# Altium schematic sheet Power.SchDoc
size A4
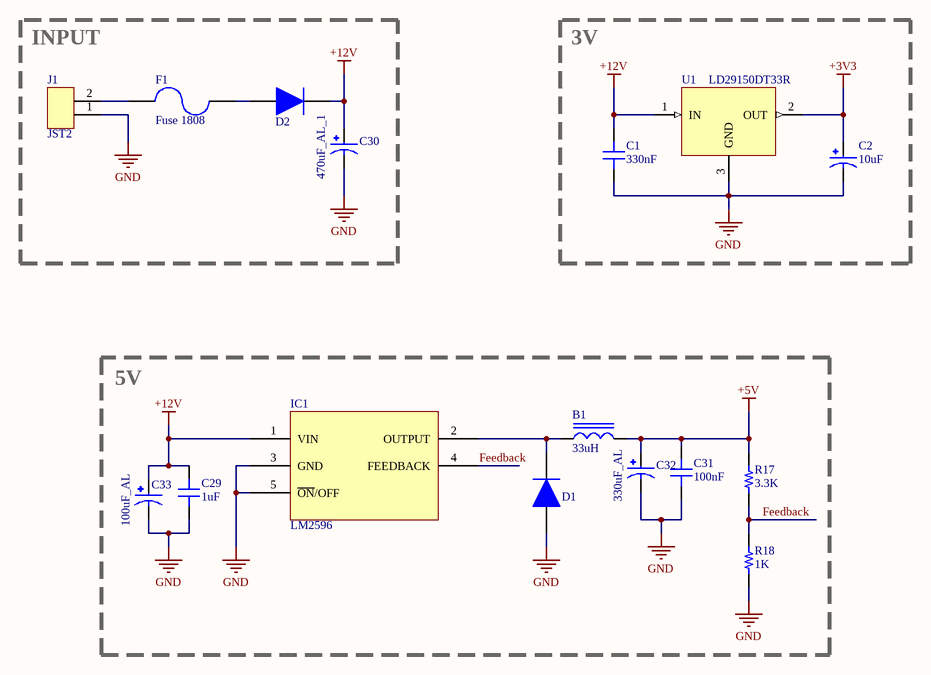
[diagram p0: Power.SchDoc]

## Parts
B1  33uH  [DR125]
C1  330nF  [CAP 0603_1608]
C2  10uF  [TANTAL B-CASE]
C29  1uF  [CAP 0603_1608]
C30  470uF_AL_1  [10x12 Al Cap]
C31  100nF  [CAP 0603_1608]
C32  330uF_AL  [10x12 Al Cap]
C33  100uF_AL  [10x12 Al Cap]
D1  1N4148WS  [SOD323F]  (value not drawn)
D2  1N4148WS  [SOD323F]  (value not drawn)
F1  Fuse 1808  [1808]
IC1  LM2596  [D2PAK]
J1  JST2  [JST2]
R17  3.3K  [RES 0603_1608]
R18  1K  [RES 0603_1608]
U1  LD29150DT33R  [TO252-3 DPAK]

## Blocks framed on the sheet
INPUT: C30 D2 F1 J1
3V: C1 C2 U1
5V: B1 C29 C31-C33 D1 IC1 R17 R18

## Nets
+3V3: C2.+ U1.2(OUT)
+5V: B1.2 C31.2 C32.1(+) R17.2
+12V: C1.2 C29.2 C30.1(+) C33.1(+) D2.1 IC1.1(VIN) U1.1(IN)
GND: C1.1 C2.- C29.1 C30.2(-) C31.1 C32.2(-) C33.2(-) D1.2 IC1.3(GND) IC1.5(~{ON}/OFF) J1.1 R18.1 U1.3(GND)
Feedback: IC1.4(FEEDBACK) R17.1 R18.2
NetB1_1: B1.1 D1.1 IC1.2(OUTPUT)
NetD2_2: D2.2 F1.2
NetF1_1: F1.1 J1.2

## Library data of the parts
B1 = 33uH: DR125
C1 = 330nF: CERAMİC 1206 SMD
C2 = 10uF: TANTAL
C29 = 1uF: CERAMİC 1206 SMD
C30 = 470uF_AL_1: Aluminium Electrolytic Capacitors; ComponentLink1Description: Vishay; ComponentLink1URL: https://www.mouser.com.tr/datasheet/2/427/136rvi-1762300.pdf
C31 = 100nF: CERAMİC 1206 SMD
C32 = 330uF_AL: Aluminium Electrolytic Capacitors; ComponentLink1Description: Vİshay; ComponentLink1URL: https://www.mouser.com.tr/datasheet/2/427/136rvi-1762300.pdf
C33 = 100uF_AL: Aluminium Electrolytic Capacitors; ComponentLink1Description: Vishay; ComponentLink1URL: https://www.mouser.com.tr/datasheet/2/427/136rvi-1762300.pdf
D1 D2 = 1N4148WS: Diode, Single, 75 V, 150 mA, 1 V, 4 ns; Manufacturer: ON Semiconductor / Fairchild; Forward Current: 150mA; Reverse Recovery Time: 4ns; Max Repetitive Reverse Voltage (Vrrm): 75V; Power Dissipation: 200mW; Max Reverse Current: 5uA; Forward Voltage: 1V; Max Forward Surge Current (Ifsm): 2A; Supplier 1: Digi-Key; Manufacturer Part Number: 1N4148WS; RoHS: Yes; Category: Rectifier Diodes; Stock 1: 79118; Pricing 1: 1=0,17000, 10=0,12100, 100=0,06530, 500=0,05128, 1000=0,03562 (USD); Mount: Surface Mount; Number of Pins: 2; Contact Plating: Tin,Matte; Weight: 0.0276g; Min Operating Temperature: -55°C; Max Operating Temperature: 150°C; Packaging: Tape and Reel; Package Quantity: 1; Recovery Time: 4ns; Average Rectified Current: 150mA; Element Configuration: Single; Reverse Voltage: 75V; Max Reverse Voltage (DC): 75V; Series: -; Length: 1.8mm; Width: 1.35mm; Height: 1mm; Radiation Hardening: No; REACH SVHC: No SVHC; Lead Free: Lead Free; RoHS Compliant: Yes; ComponentLink1URL: https://datasheet.ciiva.com/25968/1n914bws-25968945.pdf?src-supplier=Avnet+Europe; ComponentLink1Description: https://datasheet.ciiva.com/25968/1n914bws-25968945.pdf?src-supplier=Avnet+Europe; ComponentLink2URL: https://datasheet.ciiva.com/30479/0900766b810e1cd3-30479206.pdf?src-supplier=RSComponents; ComponentLink2Description: https://datasheet.ciiva.com/30479/0900766b810e1cd3-30479206.pdf?src-supplier=RSComponents; ComponentLink3URL: https://datasheet.ciiva.com/910/1n4148ws-910381.pdf?src-supplier=Digi-Key; ComponentLink3Description: https://datasheet.ciiva.com/910/1n4148ws-910381.pdf?src-supplier=Digi-Key; ComponentLink4URL: https://datasheet.ciiva.com/15208/getdatasheetpartid-127819-15208358.pdf?src-supplier=Verical; ComponentLink4Description: https://datasheet.ciiva.com/15208/getdatasheetpartid-127819-15208358.pdf?src-supplier=Verical; ComponentLink5URL: https://datasheet.ciiva.com/8300/1n914bws-8300360.pdf?src-supplier=Avnet; ComponentLink5Description: https://datasheet.ciiva.com/8300/1n914bws-8300360.pdf?src-supplier=Avnet; ComponentLink6URL: https://datasheet.ciiva.com/910/1n4148ws-910380.pdf?src-supplier=Digi-Key; ComponentLink6Description: https://datasheet.ciiva.com/910/1n4148ws-910380.pdf?src-supplier=Digi-Key; ComponentLink7URL: https://datasheet.ciiva.com/910/1n4148ws-910382.pdf?src-supplier=Digi-Key; ComponentLink7Description: https://datasheet.ciiva.com/910/1n4148ws-910382.pdf?src-supplier=Digi-Key; Supplier Part Number 1: 1N4148WSFSCT-ND
F1 = FUSE: FUSE BRD MNT 125VAC/VDC; ComponentLink1Description: Direnc.net; ComponentLink1URL: https://www.direnc.net/1a-smd-sigorta; ComponentLink2Description: Motorobit; ComponentLink2URL: https://www.motorobit.com/urun/1a-1808-kilif-smd-sigorta; ComponentLink3Description: Datasheet; ComponentLink3URL: https://www.littelfuse.com/~/media/electronics/datasheets/fuses/littelfuse_fuse_452_454_datasheet.pdf.pdf; ComponentLink4Description: Step; ComponentLink4URL: https://www.3dcontentcentral.com.tr/secure/download-model.aspx?catalogid=171&id=343808; ComponentLink5Description: Özdisan; ComponentLink5URL: https://www.ozdisan.com/devre-koruyucular/sigorta-bilesenleri/sigortalar/0454001-NR
IC1 = LM2596: Buck Converter
J1 = JST2: 2 PIN 2.54MM
R17 = 3.3K: SMT RES 1206
R18 = 1K: SMT RES 1206
U1 = LD29150: IC-29150 REG LDO 3V3 1.5A DPAK; ComponentLink1Description: Özdisan; ComponentLink1URL: https://ozdisan.com/entegre-devreler-ics/guc-entegreleri/lineer-voltaj-regulatorleri/LD29150DT33R